# EAGLE design PCB-SSB-1x4 (EAGLE 6.4)
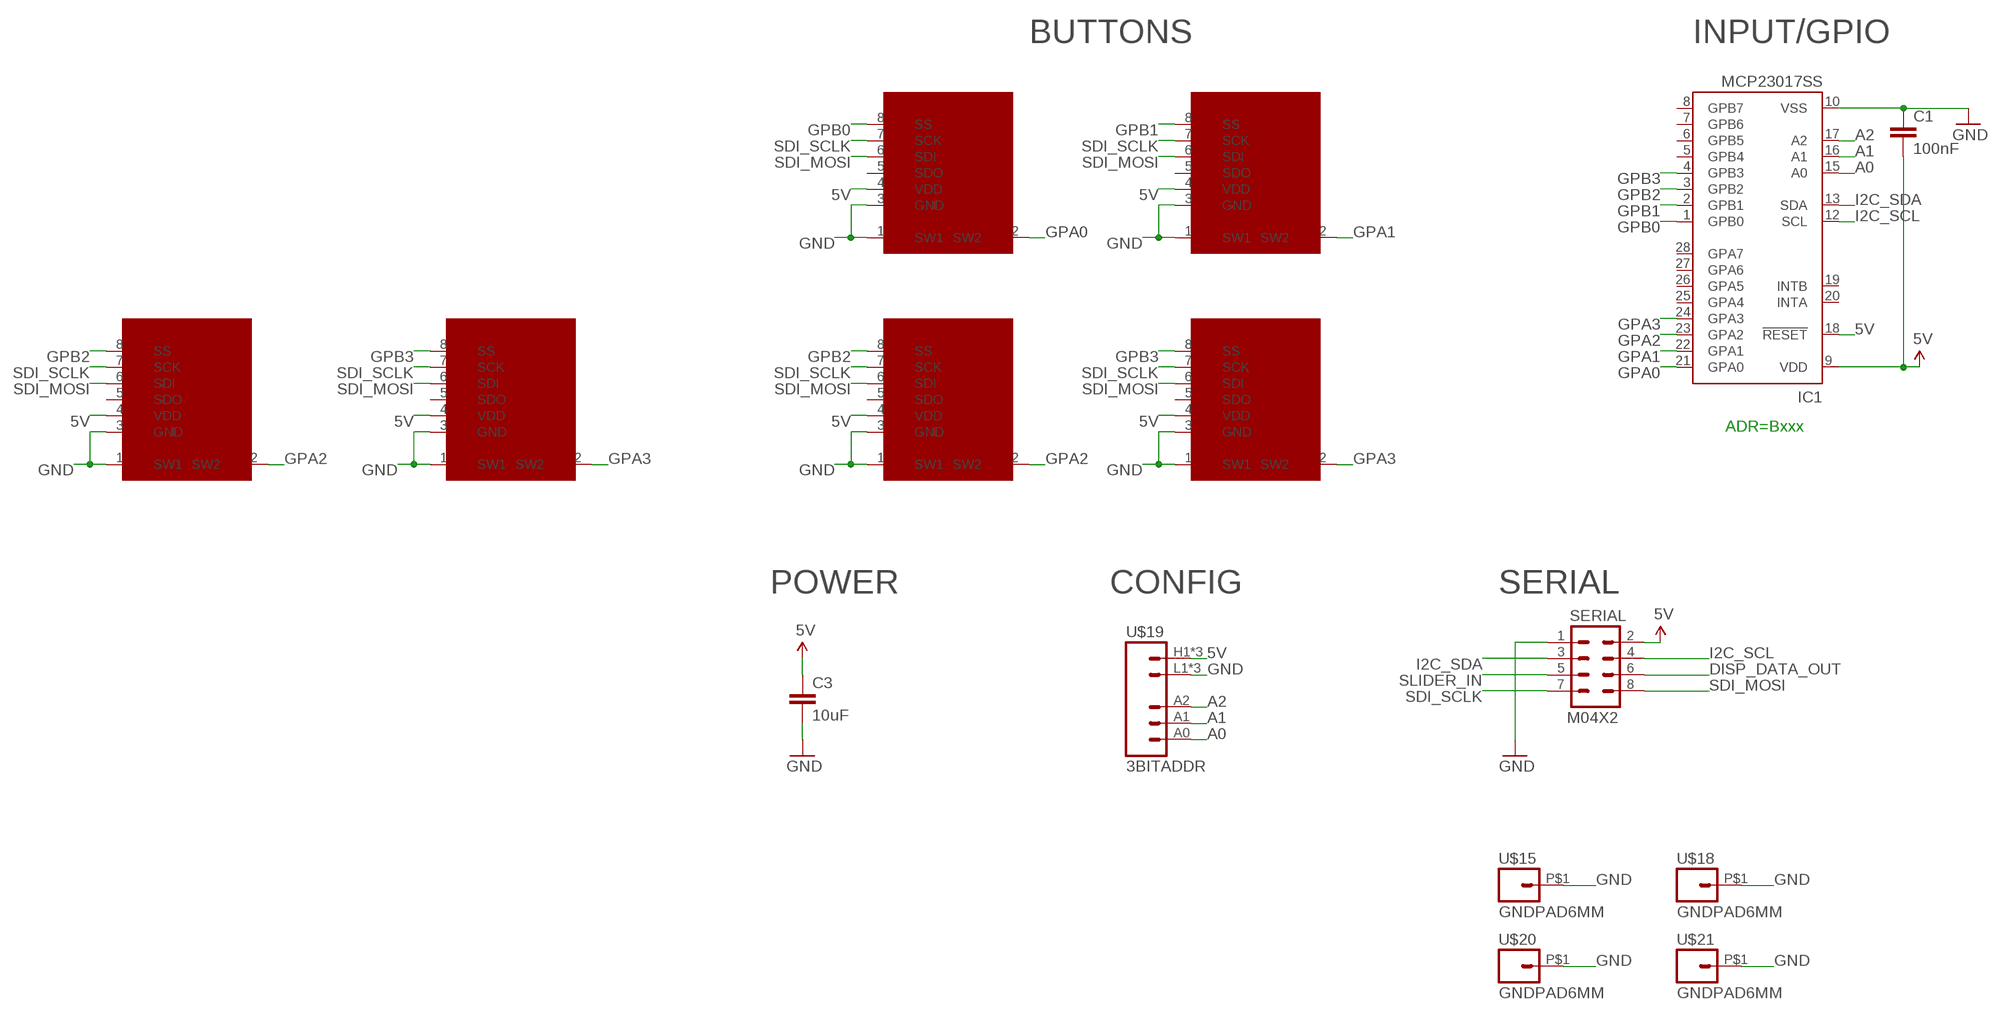
[diagram p0: schematic, sheet 1]

## Parts
C1  100nF  CAP0603-CAP  [0603-CAP]
C3  10uF  CAP0805  [0805]
IC1  MCP23017SS  [SSOP28]
SERIAL  M04X2  [2X4]
SSW1  SMART_SWITCHSMART_SWITCH_8PIN  [SMART_SWITCH]
SSW2  SMART_SWITCHSMART_SWITCH_8PIN  [SMART_SWITCH]
SSW3  SMART_SWITCHSMART_SWITCH_8PIN  [SMART_SWITCH]
SSW3ALT  SMART_SWITCHSMART_SWITCH_8PIN  [SMART_SWITCH]
SSW4  SMART_SWITCHSMART_SWITCH_8PIN  [SMART_SWITCH]
SSW4ALT  SMART_SWITCHSMART_SWITCH_8PIN  [SMART_SWITCH]
U$15  GNDPAD6MM  [3.2MMPAD6MM]
U$18  GNDPAD6MM  [3.2MMPAD6MM]
U$19  3BITADDR  [3BITADDR]
U$20  GNDPAD6MM  [3.2MMPAD6MM]
U$21  GNDPAD6MM  [3.2MMPAD6MM]

## Nets
5V [Power]: C1.2 C3.1 IC1.9(VDD) IC1.18(!RESET) SERIAL.2 SSW1.4(VDD) SSW2.4(VDD) SSW3.4(VDD) SSW3ALT.4(VDD) SSW4.4(VDD) SSW4ALT.4(VDD) U$19.H1(VCC) U$19.H2(VCC) U$19.H3(VCC)
A0: IC1.15(A0) U$19.A0
A1: IC1.16(A1) U$19.A1
A2: IC1.17(A2) U$19.A2
DISP_DATA_OUT: SERIAL.6
GND [Power]: C1.1 C3.2 IC1.10(VSS) SERIAL.1 SSW1.1(SW1) SSW1.3(GND) SSW2.1(SW1) SSW2.3(GND) SSW3.1(SW1) SSW3.3(GND) SSW3ALT.1(SW1) SSW3ALT.3(GND) SSW4.1(SW1) SSW4.3(GND) SSW4ALT.1(SW1) SSW4ALT.3(GND) U$15.P$1 U$18.P$1 U$19.L1(GND) U$19.L2(GND) U$19.L3(GND) U$20.P$1 U$21.P$1
GPA0: IC1.21(GPA0) SSW1.2(SW2)
GPA1: IC1.22(GPA1) SSW2.2(SW2)
GPA2: IC1.23(GPA2) SSW3.2(SW2) SSW3ALT.2(SW2)
GPA3: IC1.24(GPA3) SSW4.2(SW2) SSW4ALT.2(SW2)
GPB0: IC1.1(GPB0) SSW1.8(SS)
GPB1: IC1.2(GPB1) SSW2.8(SS)
GPB2: IC1.3(GPB2) SSW3.8(SS) SSW3ALT.8(SS)
GPB3: IC1.4(GPB3) SSW4.8(SS) SSW4ALT.8(SS)
I2C_SCL: IC1.12(SCL) SERIAL.4
I2C_SDA: IC1.13(SDA) SERIAL.3
SDI_MOSI: SERIAL.8 SSW1.6(SDI) SSW2.6(SDI) SSW3.6(SDI) SSW3ALT.6(SDI) SSW4.6(SDI) SSW4ALT.6(SDI)
SDI_SCLK: SERIAL.7 SSW1.7(SCK) SSW2.7(SCK) SSW3.7(SCK) SSW3ALT.7(SCK) SSW4.7(SCK) SSW4ALT.7(SCK)
SLIDER_IN: SERIAL.5
Unconnected: IC1.5(GPB4) IC1.6(GPB5) IC1.7(GPB6) IC1.8(GPB7) IC1.19(INTB) IC1.20(INTA) IC1.25(GPA4) IC1.26(GPA5) IC1.27(GPA6) IC1.28(GPA7) SSW1.5(SDO) SSW2.5(SDO) SSW3.5(SDO) SSW3ALT.5(SDO) SSW4.5(SDO) SSW4ALT.5(SDO)

## Notes on the sheet
- BUTTONS | INPUT/GPIO
- ADR=Bxxx
- POWER | CONFIG | SERIAL

## Library data of the parts
C1 C3 = SparkFun:CAP: Capacitor Standard 0603 ceramic capacitor, and 0.1" leaded capacitor.
IC1 = microchip:MCP23017: http://ww1.microchip.com/downloads/en/DeviceDoc/21952a.pdf Source: http://ww1.microchip.com/downloads/en/DeviceDoc/21952a.pdf; MF: MICROCHIP; MPN: MCP23017-E/SS; OC_FARNELL: 1467674; OC_NEWARK: 31K2960
SERIAL = SparkFun:M04X2
SSW1-SSW3 SSW3ALT SSW4 SSW4ALT = SKAARHOJ:SMART_SWITCH: SMARTSWITCH IS15DSBFP4RGB www.nkksmartswitch.com
U$15 U$18 U$20 U$21 = SKAARHOJ:GNDPAD
U$19 = SKAARHOJ:3BITADDR

## Net classes
0 default: width 0.203 mm, drill 0.406 mm, clearance 0.203 mm
1 Power: width 0.406 mm, drill 0.61 mm, clearance 0.203 mm

## Board
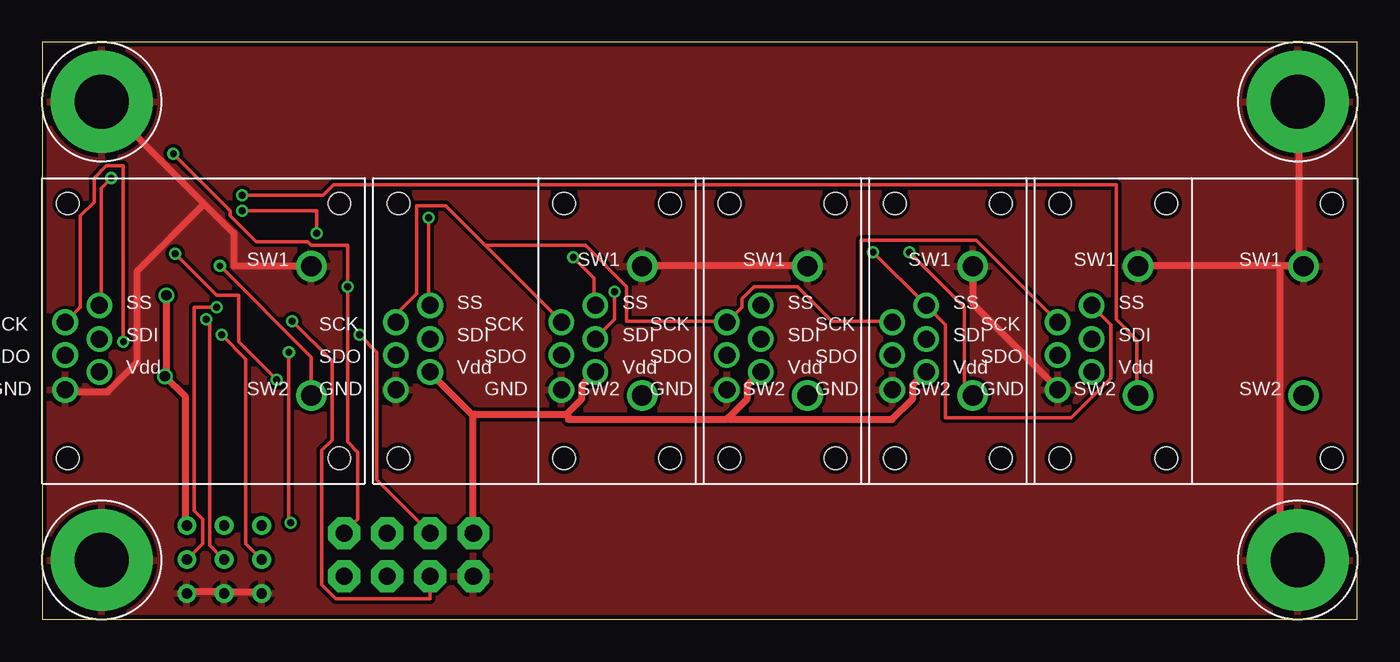
[diagram p1: board, top side]
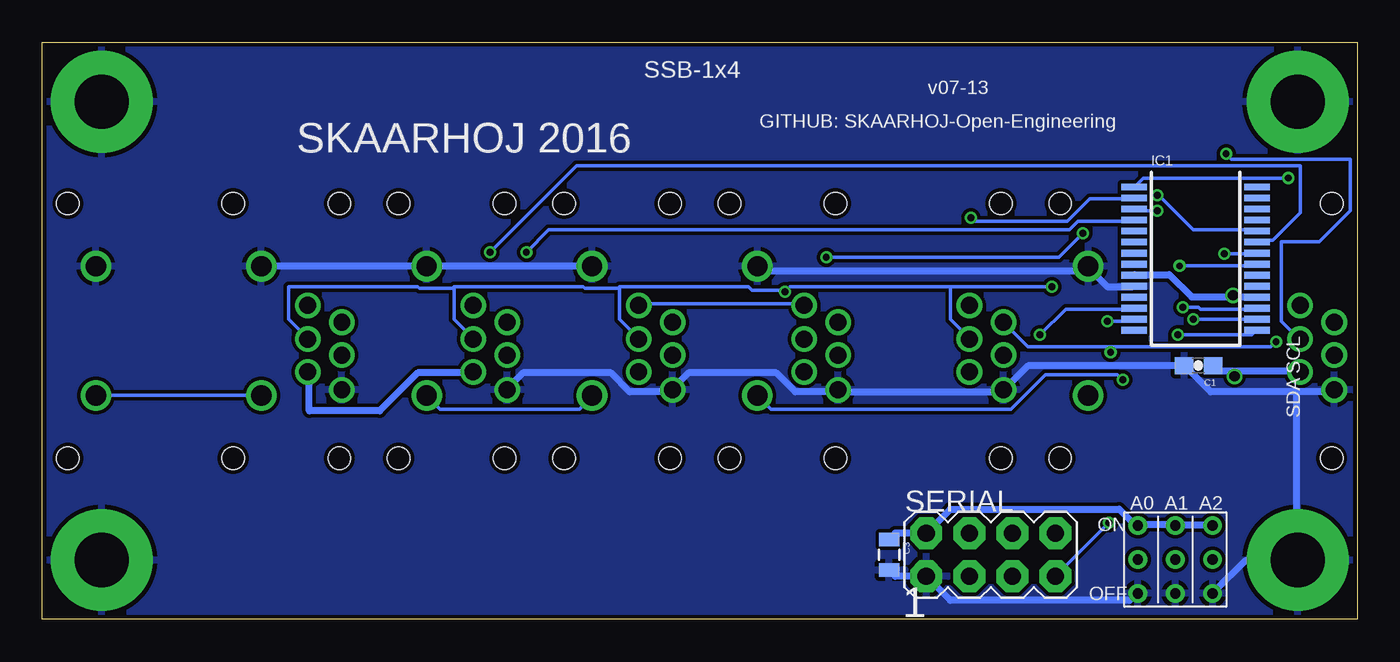
[diagram p2: board, bottom side, seen from below]

Size 77.5 x 34 mm. Coordinates in mm from the lower left corner, seen from the top.
Outline: 0,0 77.5,0 77.5,34 0,34 0,0
Copper layers (1*16): Top 0.035mm / dielectric 1.5mm / Bottom 0.035mm
Design rules "Fusion_eagle_rule_v1.1": minimum track width 6mil, minimum drill 12mil, track to track 6mil, track to pad 6mil, pad to pad 6mil, via to via 6mil, smd to smd 0mil, copper to edge 10mil, drill to drill 10mil, minimum pad ring 10mil, minimum via ring 6mil, stop-mask expansion 2mil, vias tented up to drill 100mil, thermal gap 10mil

### Footprints (pad centres in the part's own frame; a part is rotated, then mirrored left to right if it is on the bottom)
0603-CAP = smd 1.1 x 1: 1 -0.85,0; 2 0.85,0
0805 = smd 0.8 x 1.2: 1 -0.9,0; 2 0.9,0
SSOP28 = smd 0.4 x 1.5: 1 -4.225,-3.625; 2 -3.575,-3.625; 3 -2.925,-3.625; 4 -2.275,-3.625; 5 -1.625,-3.625; 6 -0.975,-3.625; 7 -0.325,-3.625; 8 0.325,-3.625; 9 0.975,-3.625; 10 1.625,-3.625; 11 2.275,-3.625; 12 2.925,-3.625; 13 3.575,-3.625; 14 4.225,-3.625; 15 4.225,3.625; 16 3.575,3.625; 17 2.925,3.625; 18 2.275,3.625; 19 1.625,3.625; 20 0.975,3.625; 21 0.325,3.625; 22 -0.325,3.625; 23 -0.975,3.625; 24 -1.625,3.625; 25 -2.275,3.625; 26 -2.925,3.625; 27 -3.575,3.625; 28 -4.225,3.625
2X4 = drill 1.016 pad 1.88 octagon: 1 -3.81,-1.27; 2 -3.81,1.27; 3 -1.27,-1.27; 4 -1.27,1.27; 5 1.27,-1.27; 6 1.27,1.27; 7 3.81,-1.27; 8 3.81,1.27
SMART_SWITCH = drill 1.2: 1 6.35,3.81; 2 6.35,-3.81 | drill 1: 3 -8.153,-3.48; 4 -6.147,-2.413; 5 -8.153,-1.422; 6 -6.147,-0.483; 7 -8.153,0.508; 8 -6.147,1.499 | hole 1.3: -8.001,7.506; 8.001,7.506; 8.001,-7.506; -8.001,-7.506
3.2MMPAD6MM = drill 3.2 pad 6: P$1 0,0
3BITADDR = drill 0.6: A0 -2.2,0; A1 0,0; A2 2.2,0; H1 -2.2,2; H2 0,2; H3 2.2,2; L1 -2.2,-2; L2 0,-2; L3 2.2,-2

### Placement (x,y rotation side)
C1  9.35,14.96 0 bottom
C3  27.58,3.81 270 bottom
IC1  9.53,21.26 270 bottom
SERIAL  21.59,3.81 0 bottom
SSW1  9.5,17 0 top
SSW2  29,17 0 top
SSW3  48.5,17 0 top
SSW3ALT  38.75,17 0 top
SSW4  68,17 0 top
SSW4ALT  58.25,17 0 top
U$15  3.5,3.5 0 top
U$18  3.5,30.5 0 top
U$19  10.72,3.53 0 bottom
U$20  74,30.5 0 top
U$21  74,3.5 0 top

### Tracks (layer width: path | path; a pad name or v marks a point on that pad's centre or on a via)
5V  (via drill 0.61)
  Top 0.406: 25.4,11.99 22.86,14.53 SSW2.4 | SERIAL.2 25.4,11.99 | 30.89,12.09 31.8,13.01 31.8,13.82 32.51,14.53 SSW3ALT.4 | 30.89,12.09 25.5,12.09 25.4,11.99 | 40.44,11.89 40.34,11.79 30.99,11.79 30.99,11.99 30.89,12.09 | 40.44,11.89 41.55,13.01 41.55,13.82 42.27,14.53 SSW3.4 | SSW4ALT.4 52.02,14.53 51.31,13.82 51.31,13.01 50.09,11.79 40.54,11.79 40.44,11.89 | U$19.H3 8.43,5.59 8.43,13.11 v7.21,14.33 7.32,14.43 v7.32,19.1
  Bottom 0.406: 7.32,19 9.75,19 11.07,20.32 13.11,20.32 IC1.9 | 7.32,19 5.99,19 IC1.18 | 7.21,14.63 3.45,14.63 SSW1.4 | 7.21,14.63 8.13,14.63 8.43,14.94 C1.2 | U$19.H3 8.53,5.59 10.67,5.59 U$19.H2 10.87,5.59 12.9,5.59 U$19.H1 13.11,5.59 14.02,6.5 23.98,6.5 SERIAL.2 27.23,5.08 27.53,4.78 C3.1 | SSW4.4 61.77,14.53 61.77,12.29 57.61,12.29 55.37,14.53 52.12,14.53 SSW4ALT.4 | v7.21,14.33 7.21,14.63 | v7.32,19.1 7.32,19
A0  (via drill 0.41)
  Top 0.203: v10.57,16.76 11.99,15.34 11.99,4.47 12.9,3.56 U$19.A0
  Bottom 0.203: v10.57,16.76 6.2,16.76 5.99,16.97 IC1.15
A1  (via drill 0.41)
  Top 0.203: v9.65,17.68 9.86,17.48 9.86,4.37 10.67,3.56 U$19.A1
  Bottom 0.203: v9.65,17.68 5.99,17.68 IC1.16
A2  (via drill 0.41)
  Top 0.203: v10.26,18.39 8.94,18.39 8.94,6.4 9.45,5.89 9.45,4.47 8.53,3.56 U$19.A2
  Bottom 0.203: v10.26,18.39 9.35,18.39 9.25,18.29 5.99,18.29 IC1.17
GND
  Top 0.406: SSW2.1 35.36,20.83 45.01,20.83 SSW3ALT.1 | SSW4.3 59.84,13.61 54.86,18.59 54.86,20.73 SSW3.1 | 72.95,20.83 74.27,20.83 SSW4.1 74.27,21.03 74.07,21.23 74.07,30.48 U$20.P$1 | 72.95,20.83 64.62,20.83 SSW4ALT.1 | 72.95,20.83 72.95,4.57 73.97,3.56 U$21.P$1 | 9.55,24.49 3.56,30.48 U$18.P$1 | 9.55,24.49 11.28,22.76 11.28,20.83 15.85,20.83 SSW1.1 | U$19.L3 8.53,1.63 10.67,1.63 U$19.L2 10.87,1.63 12.9,1.63 U$19.L1 | 9.55,24.49 5.59,20.52 5.59,15.14 3.86,13.41 1.42,13.41 1.42,13.51 SSW1.3
  Bottom 0.406: SSW3ALT.1 45.11,20.83 54.76,20.83 SSW3.1 54.97,20.83 64.52,20.83 SSW4ALT.1 | IC1.10 13.21,19.61 14.73,19.61 15.85,20.73 SSW1.1 15.85,20.52 35.05,20.52 35.26,20.73 SSW2.1 | SSW4ALT.3 50.09,13.61 49.17,14.53 43.99,14.53 42.88,13.41 40.44,13.41 SSW3.3 40.34,13.61 39.42,14.53 34.24,14.53 33.12,13.41 30.68,13.41 SSW3ALT.3 30.58,13.51 30.48,13.41 21.03,13.41 20.93,13.51 SSW2.3 20.73,13.61 19.41,14.94 10.36,14.94 C1.1 10.16,14.94 8.64,13.41 3.56,13.41 | 3.56,13.41 1.52,13.41 1.42,13.51 SSW1.3 | C3.2 27.53,2.85 27.23,2.54 SERIAL.1 23.98,1.12 13.41,1.12 13.01,1.52 U$19.L1 | U$19.L3 8.43,1.63 6.6,3.45 3.56,3.45 U$15.P$1 3.56,3.66 3.56,13.41
  pour Top: 0,0 77.47,0 77.47,34.29 0,34.29
  pour Bottom: 0,0 77.47,0 77.47,34.29 0,34.29
GPA0  (via drill 0.41)
  Top 0.203: v10.46,20.83 15.85,15.44 15.85,13.21 SSW1.2
  Bottom 0.203: v10.46,20.83 6.1,20.83 5.99,20.93 IC1.21
GPA1  (via drill 0.41)
  Top 0.203: v7.82,21.54 10.26,19.1 11.58,19.1 11.58,16.36 v13.82,14.12
  Bottom 0.203: v7.82,21.54 5.99,21.54 IC1.22 | v13.82,14.12 14.12,14.43 18.39,14.43 20.42,12.39 34.54,12.39 35.26,13.11 SSW2.2
GPA2  (via drill 0.41)
  Top 0.203: v51.1,21.64 54.36,18.39 54.36,13.61 54.76,13.21 SSW3.2
  Bottom 0.203: v51.1,21.64 46.02,26.72 3.35,26.72 3.35,23.98 4.98,22.35 5.79,22.35 5.89,22.25 IC1.23 | SSW3ALT.2 45.11,13.11 45.82,12.39 54.05,12.39 54.76,13.11 SSW3.2
GPA3  (via drill 0.41)
  Top 0.203: v11.79,24.99 16.56,24.99 17.17,25.6 63.3,25.6 63.3,17.68 64.52,16.46 64.52,13.21 SSW4ALT.2
  Bottom 0.203: v11.79,24.99 11.68,24.99 9.65,22.96 5.99,22.96 IC1.24 | SSW4.2 74.27,13.21 64.62,13.21 SSW4ALT.2
GPB0  (via drill 0.41)
  Top 0.203: v4.06,26.01 3.45,25.4 3.45,18.59 SSW1.8
  Bottom 0.203: v4.06,26.01 12.6,26.01 13.11,25.5 IC1.1
GPB1  (via drill 0.41)
  Top 0.203: v22.76,23.67 22.76,18.59 SSW2.8
  Bottom 0.203: v22.76,23.67 22.55,23.47 17.07,23.47 15.75,24.79 13.21,24.79 IC1.2
GPB2  (via drill 0.41)
  Top 0.203: v11.79,24.08 16.15,24.08 v16.15,22.76 | v31.29,21.34 32.51,20.12 32.51,18.59 SSW3ALT.8
  Bottom 0.203: v11.79,24.08 13.01,24.08 13.11,24.18 IC1.3 | v16.15,22.76 17.58,21.34 v31.29,21.34 | SSW3.8 42.27,18.59 32.61,18.59 SSW3ALT.8
GPB3  (via drill 0.41)
  Top 0.203: v48.97,21.64 52.02,18.59 SSW4ALT.8 52.12,18.49 53.24,17.37 53.24,11.89 60.66,11.89 62.99,14.22 62.99,17.37 61.87,18.49 SSW4.8
  Bottom 0.203: v48.97,21.64 47.65,22.96 16.97,22.96 16.46,23.47 13.21,23.47 IC1.4
I2C_SCL  (via drill 0.41)
  Top 0.203: v18.69,16.76 19.71,15.75 19.71,8.23 SERIAL.4
  Bottom 0.203: v18.69,16.76 17.17,18.29 13.21,18.29 IC1.12
I2C_SDA  (via drill 0.41)
  Top 0.203: v14.73,17.58 17.07,15.24 17.07,10.57 16.46,9.96 16.46,2.03 17.27,1.22 22.86,1.22 SERIAL.3
  Bottom 0.203: v14.73,17.58 13.31,17.58 13.21,17.68 IC1.13
SDI_MOSI  (via drill 0.41)
  Top 0.203: v7.72,27.43 11.07,24.08 11.07,23.77 12.6,22.25 15.65,22.25 15.85,22.05 17.98,22.05 v17.98,19.61 17.98,10.46 18.59,9.86 18.59,5.89 SERIAL.8 | v33.73,19.3 33.73,17.68 32.61,16.56 SSW3ALT.6
  Bottom 0.203: v7.72,27.43 7.42,27.13 0.41,27.13 0.41,24.08 2.23,22.25 4.47,22.25 4.47,17.58 3.45,16.56 SSW1.6 | 23.98,19.61 23.98,17.68 22.86,16.56 SSW2.6 | v17.98,19.61 23.98,19.61 | 23.98,19.61 33.43,19.61 v33.73,19.3 33.73,19.41 35.66,19.41 35.87,19.61 43.48,19.61 43.48,19.51 | 43.48,19.51 43.48,17.68 42.37,16.56 SSW3.6 | 53.24,19.51 53.24,19.61 45.62,19.61 45.52,19.51 43.48,19.51 | 53.24,19.51 53.24,17.68 52.12,16.56 SSW4ALT.6 | 53.24,19.51 55.27,19.51 55.37,19.61 62.99,19.61 62.99,17.68 61.87,16.56 SSW4.6
SDI_SCLK  (via drill 0.41)
  Top 0.203: 48.26,17.58 50.09,17.58 SSW4ALT.7 | 48.26,17.58 46.53,17.58 44.5,19.61 41.96,19.61 41.25,18.9 41.25,18.39 40.44,17.58 SSW3.7 40.34,17.58 34.44,17.58 34.44,19.61 32,22.05 26.21,22.05 26.16,22 | 48.26,17.58 48.26,22.35 55.07,22.35 59.84,17.58 SSW4.7 | v4.78,16.36 4.78,26.72 3.76,26.72 3.05,26.01 3.05,24.59 2.23,23.77 2.23,18.39 1.42,17.58 SSW1.7 | 26.16,22 23.77,24.38 22.05,24.38 22.05,19.2 20.93,18.09 20.93,17.58 SSW2.7 | 26.16,22 30.58,17.58 SSW3ALT.7 | v14.63,5.69 14.53,5.79 v14.53,15.75
  Bottom 0.203: v4.78,16.36 5.08,16.05 14.53,16.05 | 14.53,16.05 19.41,16.05 20.83,17.48 SSW2.7 | v14.63,5.69 SERIAL.7 | 14.53,16.05 v14.53,15.75

### Text on the board
_bsilk: v07-13 | SSB-1x4 | GITHUB: SKAARHOJ-Open-Engineering | SKAARHOJ 2016 | SCL | SDA | 1